# EAGLE design cable_tester (EAGLE 9.6.2)
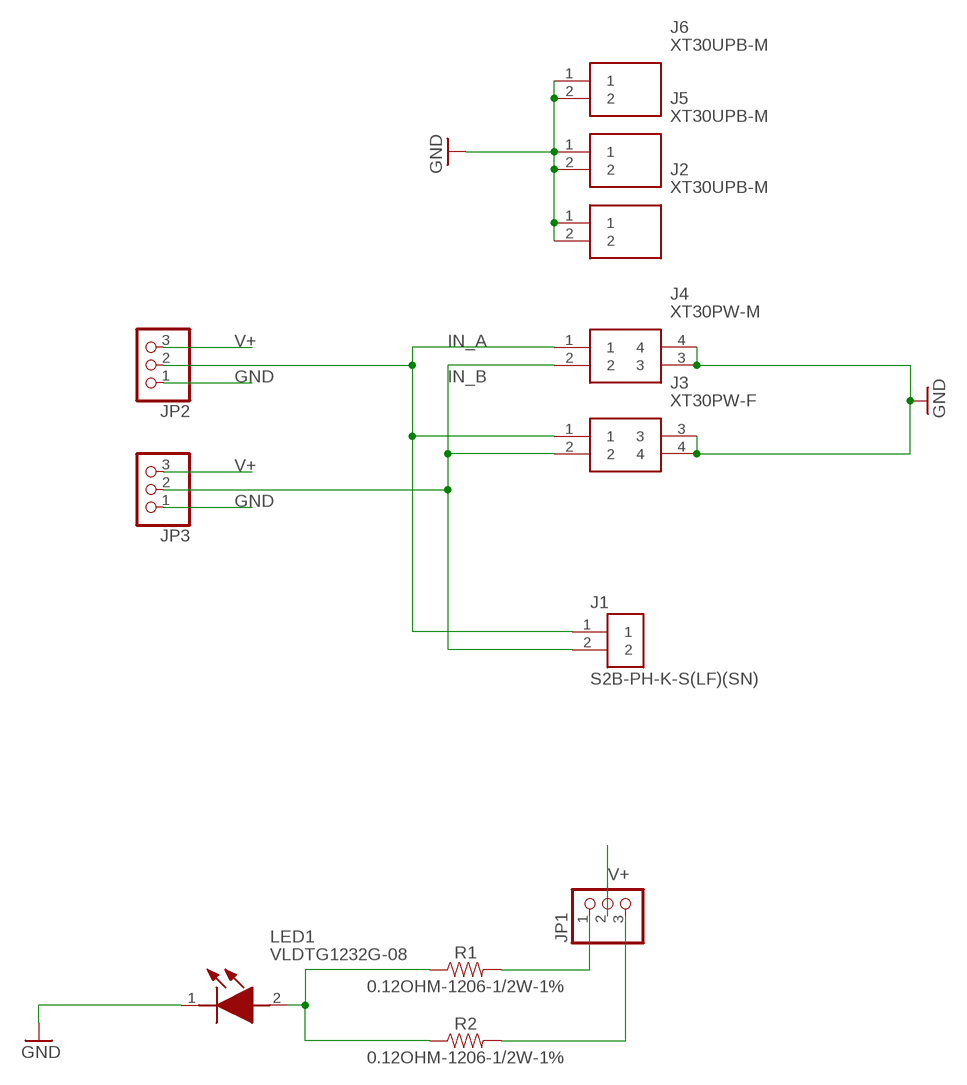
[diagram p0: schematic, sheet 1]

## Parts
J1  S2B-PH-K-S(LF)(SN)  [S2B-PH-K-S(LF)(SN)]
J2  XT30UPB-M  [SHDR2W160P0X500_1X2_1020X520X1]
J3  XT30PW-F  [XT30PWF]
J4  XT30PW-M  [XT30PWM]
J5  XT30UPB-M  [SHDR2W160P0X500_1X2_1020X520X1]
J6  XT30UPB-M  [SHDR2W160P0X500_1X2_1020X520X1]
JP1  PINHD-1X3  [1X03]
JP2  PINHD-1X3  [1X03]
JP3  PINHD-1X3  [1X03]
LED1  VLDTG1232G-08  [VLDTG1232G08]
R1  0.12OHM-1206-1/2W-1%  [1206]
R2  0.12OHM-1206-1/2W-1%  [1206]

## Nets
GND: J2.1 J2.2 J3.3 J3.4 J4.3 J4.4 J5.1 J5.2 J6.1 J6.2 JP2.1 JP3.1 LED1.1(K)
IN_A: J1.1 J3.1 J4.1 JP2.2
IN_B: J1.2 J3.2 J4.2 JP3.2
N$1: LED1.2(A) R1.1 R2.1
N$3: JP1.1 R1.2
N$4: JP1.3 R2.2
V+: JP1.2 JP2.3 JP3.3

## Library data of the parts
J1 = Connectors:S2B-PH-K-S(LF)(SN): CONN HEADER R/A 2POS 2MM Manufacturer's datasheet <http://www.jst-mfg.com/product/pdf/eng/ePH.pdf>; CREATED_BY: PCBLayout.com; DIGI_KEY_PART_NUMBER: 455-1719-ND; MANUFACTURER: JST Sales America Inc.; MPN: S2B-PH-K-S(LF)(SN)
J2 J5 J6 = SamacSys_Parts:XT30UPB-M: Socket; DC supply; XT30; male; PIN: 2; on PCBs; THT; Colour: yellow Source: Datasheet <https://www.tme.eu/Document/4acc913878197f8c2e30d4b8cdc47230/XT30UPB SPEC.pdf>; DESCRIPTION: Socket; DC supply; XT30; male; PIN: 2; on PCBs; THT; Colour: yellow; HEIGHT: 10.7mm; MANUFACTURER_NAME: Amass; MANUFACTURER_PART_NUMBER: XT30UPB-M
J3 = SamacSys_Parts:XT30PW-F: Socket; DC supply; XT30; female; PIN:2; on PCBs; THT; Colour: yellow Source: Datasheet <https://www.tme.eu/Document/ce4077e36b79046da520ca73227e15de/XT30PW SPEC.pdf>; DESCRIPTION: Socket; DC supply; XT30; female; PIN:2; on PCBs; THT; Colour: yellow; HEIGHT: 5mm; MANUFACTURER_NAME: Amass; MANUFACTURER_PART_NUMBER: XT30PW-F
J4 = SamacSys_Parts:XT30PW-M: 30A Low Temperature Rise Fire Retardant Plug Source: Datasheet <https://www.tme.eu/sl/Document/ce4077e36b79046da520ca73227e15de/XT30PW SPEC.pdf>; DESCRIPTION: 30A Low Temperature Rise Fire Retardant Plug; HEIGHT: 5mm; MANUFACTURER_NAME: Amass; MANUFACTURER_PART_NUMBER: XT30PW-M
JP1-JP3 = adafruit:PINHD-1X3: PIN HEADER
LED1 = SamacSys_Parts:VLDTG1232G-08: Standard LEDs - SMD Green 16K mcd; 515nm Dome Lens 3V; 20mA Source: Datasheet <https://www.vishay.com/docs/80003/vldb1232.pdf>; DESCRIPTION: Standard LEDs - SMD Green 16K mcd; 515nm Dome Lens 3V; 20mA; HEIGHT: 3.02mm; MANUFACTURER_NAME: Vishay; MANUFACTURER_PART_NUMBER: VLDTG1232G-08; MOUSER_PART_NUMBER: 78-VLDTG1232G-08; MOUSER_PRICE-STOCK: https://www.mouser.co.uk/ProductDetail/Vishay-Semiconductors/VLDTG1232G-08?qs=vLWxofP3U2zDV0hybC0Sqg%3D%3D
R1 R2 = SparkFun-Resistors:0.12OHM: 0.12Ω resistor A resistor is a passive two-terminal electrical component that implements electrical resistance as a circuit element. Resistors act to reduce current flow, and, at the same time, act to lower voltage levels within circuits. - Wikipedia; PROD_ID: RES-17192

## Board
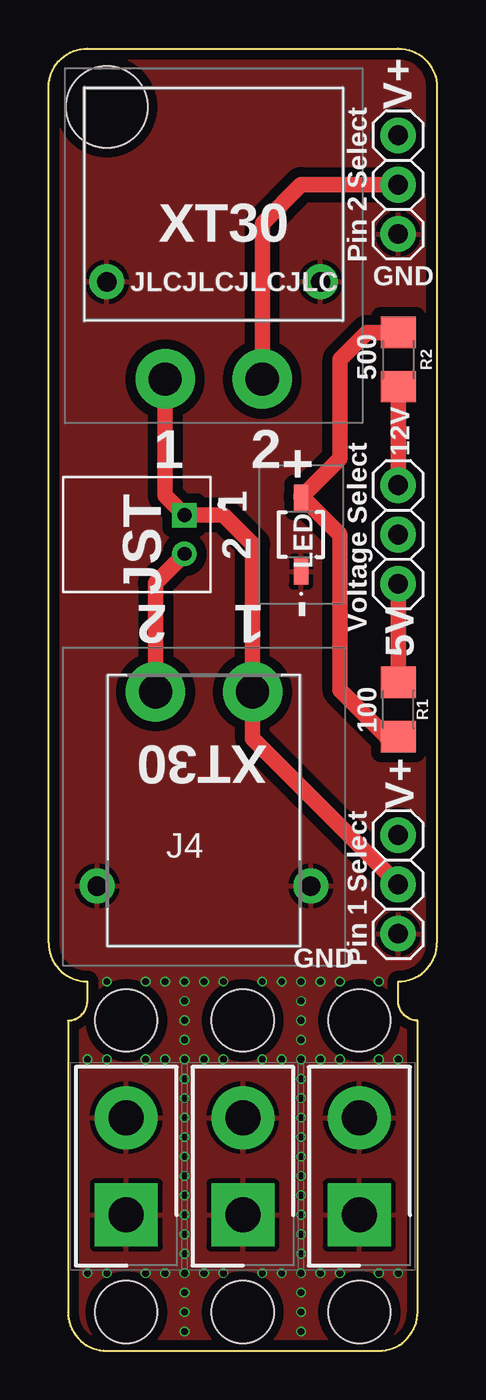
[diagram p1: board, top side]
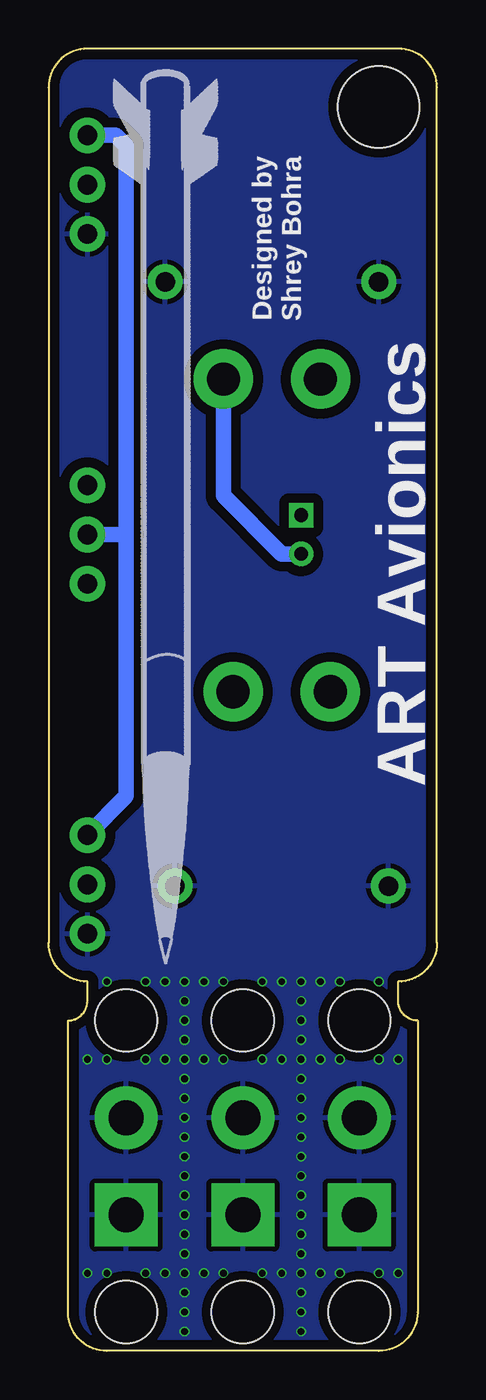
[diagram p2: board, bottom side, seen from below]

Size 20 x 67 mm. Coordinates in mm from the lower left corner, seen from the top.
Outline: 0,65 arc-90 2,67 18,67 arc-90 20,65 20,21 arc-90 18,19 18,18 arc90 19,17 19,2 arc-90 17,0 3,0 arc-90 1,2 1,17 arc90 2,18 2,19 arc-90 0,21 0,65
Copper layers (1*16): Top 0.035mm / dielectric 1.6mm / Bottom 0.035mm
Design rules "jlcpcb-2layers": minimum track width 5mil, minimum drill 0.3mm, track to track 5mil, track to pad 5mil, pad to pad 5mil, via to via 5mil, smd to smd 5mil, copper to edge 0.2mm, drill to drill 6mil, minimum pad ring 10mil, minimum via ring 3mil, stop-mask expansion 4mil, vias tented up to drill 0mil, thermal gap 10mil
Holes 3.2 mm at 4,17 10,17 16,17 4,2 10,2 16,2
Holes 4.2 mm at 3,64

### Footprints (pad centres in the part's own frame; a part is rotated, then mirrored left to right if it is on the bottom)
S2B-PH-K-S(LF)(SN) = drill 0.7 square: 1 -1,0 | drill 0.7: 2 1,0
SHDR2W160P0X500_1X2_1020X520X1 = drill 1.8 pad 2.7 square: 1 0,0 | drill 1.8 pad 2.7: 2 5,0
XT30PWF = drill 1.7 pad 2.55: 1 0,0; 2 5,0 | drill 1 pad 1.5: 3 -3,5; 4 8,5
XT30PWM = drill 1.7 pad 2.55: 1 -2.5,-5.912; 2 2.5,-5.912 | drill 1 pad 1.5: 3 5.5,4.088; 4 -5.5,4.088
1X03 = drill 1.016: 1 -2.54,0; 2 0,0; 3 2.54,0
VLDTG1232G08 = smd 1.35 x 0.75: 1 -1.9,0; 2 1.9,0
1206 = smd 1.6 x 1.8: 1 -1.4,0; 2 1.4,0

### Placement (x,y rotation side)
J1  7,42 270 top
J2  4,7 90 top
J3  6,50 0 top
J4  8,28 180 top
J5  10,7 90 top
J6  16,7 90 top
JP1  18,42 90 top
JP2  18,24 90 top
JP3  18,60 90 top
LED1  13,42 90 top
R1  18,33 90 top
R2  18,51 270 top

### Tracks (layer width: path | path; a pad name or v marks a point on that pad's centre or on a via)
GND  (via drill 0.35)
  other vias: 7,16 7,15 7,14 7,13 7,12 7,11 7,10 7,9 7,8 7,7 7,6 7,5 7,4 7,3 7,2 7,1 7,17 7,18 13,1 13,2 13,3 13,4 13,5 13,6 13,7 13,8 13,9 13,10 13,11 13,12 13,13 13,14 13,15 13,16 13,17 13,18 13,19 14,19 15,19 17,19 12,19 11,19 9,19 8,19 7,19 6,19 5,19 3,19 5,4 6,4 3,4 2,4 8,4 9,4 11,4 12,4 14,4 15,4 17,4 18,4 6,15 5,15 3,15 2,15 8,15 9,15 11,15 12,15 14,15 15,15 17,15 18,15
  pour Top (isolate 0.5): -1,69 22,69 arc90 21,68 21,-2 -1,-2
  pour Bottom (isolate 0.5): -2,70 22,70 22,-3 -2,-3
IN_A
  Top 0.8: J3.1 6,44 J1.1 9,43 10.5,41.5 J4.1 10.5,31.5 JP2.2
IN_B
  Top 0.8: J4.2 5.5,39.5 J1.2 | JP3.2 13,60 11,58 J3.2
  Bottom 0.8: J1.2 8,41 11,44 J3.2
N$1
  Top 0.8: R2.1 16.4,52.4 15,51 15,45.9 LED1.2 13,44 15,42 15,34 17.4,31.6 R1.1
N$3
  Top 0.8: JP1.1 18,36 18,35 R1.2
N$4
  Top 0.8: JP1.3 R2.2
V+
  Bottom 0.8: JP2.3 16,28.54 16,42 | JP3.3 16.54,62.54 16,62 16,42 | JP1.2 16,42

### Text on the board
tPlace: V+ | Pin 2 Select | XT30 | GND | JLCJLCJLCJLC | 500 | 12V | 1 | 2 | + | JST | 1 | LED | 2 | 2 | 1 | - | Voltage Select | 5V | 100 | XT30 | V+ | Pin 1 Select | GND
bPlace: Designed by / Shrey Bohra | ART Avionics